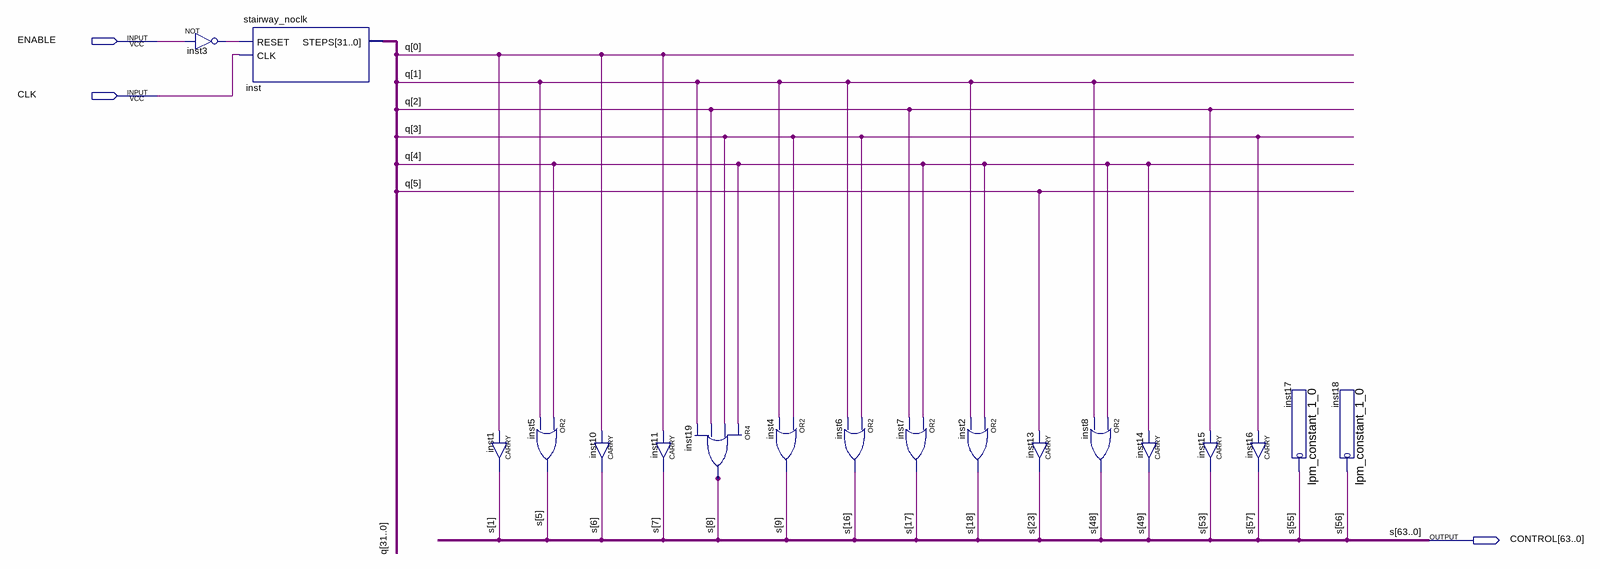
[diagram p0: schematic sheet]
// Quartus schematic macro_sla.bdf as structural Verilog: 18 symbols, 3 pins
module macro_sla (
  input  ENABLE,
  input  CLK,
  output [63:0] CONTROL
);

  wire inst3_out;
  wire [31:0] q;

  not inst3 (inst3_out, ENABLE);
  stairway_noclk inst (.RESET(inst3_out), .CLK(CLK), .STEPS(q));
  CARRY inst1 (.IN(q[0]), .OUT(CONTROL[1]));
  or inst5 (CONTROL[5], q[4], q[1]);
  CARRY inst10 (.IN(q[0]), .OUT(CONTROL[6]));
  CARRY inst11 (.IN(q[0]), .OUT(CONTROL[7]));
  or inst19 (CONTROL[8], q[4], q[3], q[2], q[1]);
  or inst4 (CONTROL[9], q[3], q[1]);
  or inst6 (CONTROL[16], q[3], q[1]);
  or inst7 (CONTROL[17], q[4], q[2]);
  or inst2 (CONTROL[18], q[4], q[1]);
  CARRY inst13 (.IN(q[5]), .OUT(CONTROL[23]));
  or inst8 (CONTROL[48], q[4], q[1]);
  CARRY inst14 (.IN(q[4]), .OUT(CONTROL[49]));
  CARRY inst15 (.IN(q[2]), .OUT(CONTROL[53]));
  CARRY inst16 (.IN(q[3]), .OUT(CONTROL[57]));
  lpm_constant_1_0 inst17 (.result(CONTROL[55]));
  lpm_constant_1_0 inst18 (.result(CONTROL[56]));

  // Other names for the same wires on the sheet: s[63:0] = CONTROL
endmodule
